# EasyEDA schematic EasyEDA_Schematic.json
TITLE: Sheet_1; REV: 1.0; Date: 2025-10-11; Sheet: 1/1; Company: Your Company
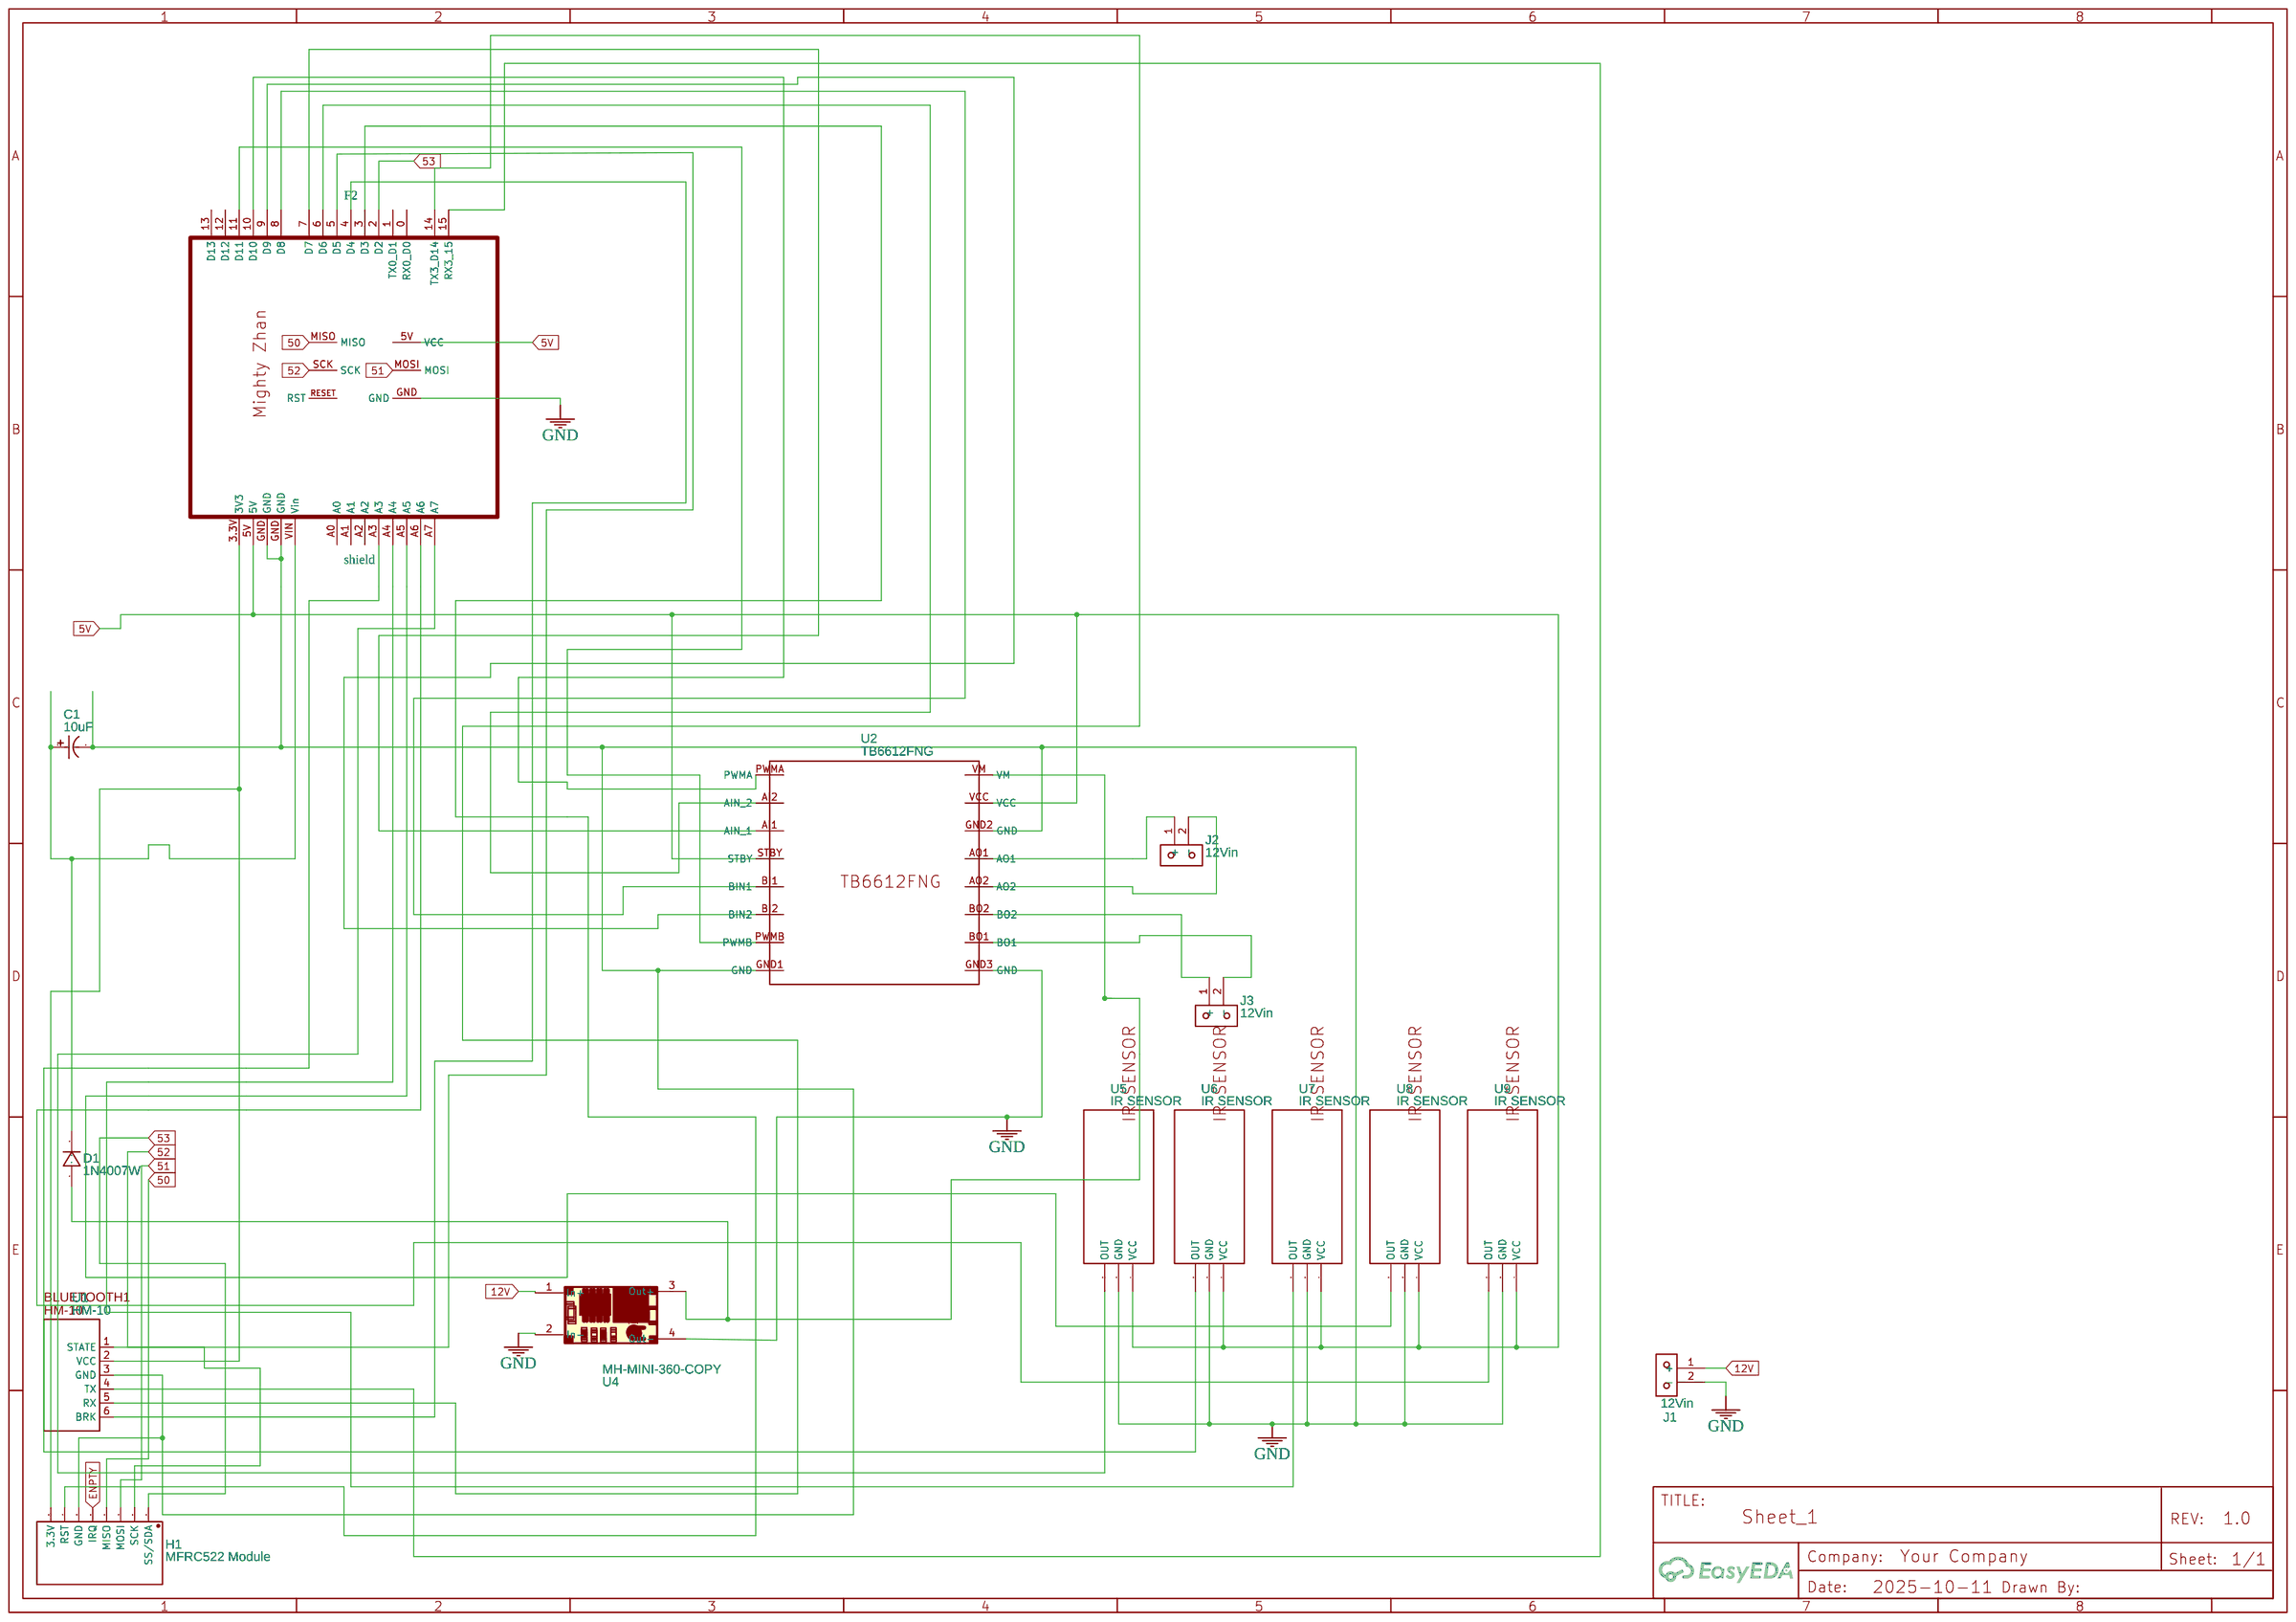
[diagram p0: schematic sheet]

## Parts
C1  10uF  [CAP-TH_BD4.0-P1.50-D0.8-FD]
D1  1N4007W  [1N4007]
F2  shield  [SHIELD]
H1  MFRC522 Module  [MFRC522]
J1  12Vin  [SWITCH]
J2  12Vin  [2P-GS014S]
J3  12Vin  [2P-GS014S]
U1  HM-10  [HM-10]
U2  TB6612FNG  [TB6612FNG]
U4  MH-MINI-360-COPY  [DSN-MINI-360]
U5  IR SENSOR  [IR_SENSOR]
U6  IR SENSOR  [IR_SENSOR]
U7  IR SENSOR  [IR_SENSOR]
U8  IR SENSOR  [IR_SENSOR]
U9  IR SENSOR  [IR_SENSOR]

## Library data of the parts
C1 = electrolytic capacitor10UF50V: Supplier: LCSC; Manufacturer: CX(承兴); Manufacturer Part: KS106M050C07RR0VH2FP0; Supplier Part: C32856; JLCPCB Part Class: Extended Part
D1 = 1N4007W: Supplier: LCSC; Supplier Part: C328592; Manufacturer: BLUE ROCKET; Contributor: LCEDA_Lib
H1 = MFRC522 Module: Manufacturer: Ckmtw; Manufacturer Part: 210S-1*8P L=11.6MMGold-plated black; Contributor: Nicolas Fourgheon
J1-J3 = ED2580-ND: Manufacturer: On Shore Technology Inc.; Manufacturer Part: OSTTA024163; Supplier: Digi-Key; Contributor: electdon; Package Display: No
U1 = HM-10: Contributor: ajchen0508
U2 = TB6612FNG: Contributor: Geovanic02; Package Display: No
U4 = MH-MINI-360-COPY: Contributor: samaramaugli84
U5-U9 = MH-Sensor-Series Line Sensor: Contributor: cintanaa.df16

## Nets
5V: F2.5V U2.STBY U2.VCC U5.4(VCC) U6.4(VCC) U7.4(VCC) U8.4(VCC) U9.4(VCC)
12V: J1.1(+) U4.1(In+)
GND: C1.2(-) F2.GND H1.6(GND) J1.2(-) U1.3(GND) U2.GND1(GND) U2.GND2(GND) U2.GND3(GND) U4.2(In-) U4.4(Out-) U5.3(GND) U6.3(GND) U7.3(GND) U8.3(GND) U9.3(GND)
50: F2.MISO H1.4(MISO)
51: F2.MOSI H1.3(MOSI)
52: F2.SCK H1.2(SCK)
53: F2.2(D2) H1.1(SS/SDA)
ENPTY: H1.5(IRQ)
Net-(C1-1): C1.1(+) D1.2(1) F2.VIN(Vin)
Net-(D1-1): D1.1(2) U2.VM U4.3(Out+)
Net-(F2-3): F2.3(D3) H1.7(RST)
Net-(F2-3.3V): F2.3.3V(3V3) H1.8(3.3V) U1.2(VCC)
Net-(F2-4): F2.4(D4) U1.6(BRK)
Net-(F2-5): F2.5(D5) U1.1(STATE)
Net-(F2-6): F2.6(D6) U2.AI2(AIN 2)
Net-(F2-7): F2.7(D7) U2.AI1(AIN 1)
Net-(F2-8): F2.8(D8) U2.BI1(BIN1)
Net-(F2-9): F2.9(D9) U2.BI2(BIN2)
Net-(F2-10): F2.10(D10) U2.PWMA
Net-(F2-11): F2.11(D11) U2.PWMB
Net-(F2-14): F2.14(TX3 D14) U1.5(RX)
Net-(F2-15): F2.15(RX3 15) U1.4(TX)
Net-(F2-A3): F2.A3 U6.2(OUT)
Net-(F2-A4): F2.A4 U7.2(OUT)
Net-(F2-A5): F2.A5 U8.2(OUT)
Net-(F2-A6): F2.A6 U9.2(OUT)
Net-(F2-A7): F2.A7 U5.2(OUT)
Net-(J2-1): J2.1(+) U2.AO1
Net-(J2-2): J2.2(-) U2.AO2
Net-(J3-1): J3.1(+) U2.BO2
Net-(J3-2): J3.2(-) U2.BO1

Not connected (* = marked no-connect by the designer): F2 0(RX0 D0) 1(TX0 D1) 12(D12) 13(D13) A0 A1 A2 RESET(RST)
